# Altium schematic sheet CW308_VoltageFollower.SchDoc
size A4
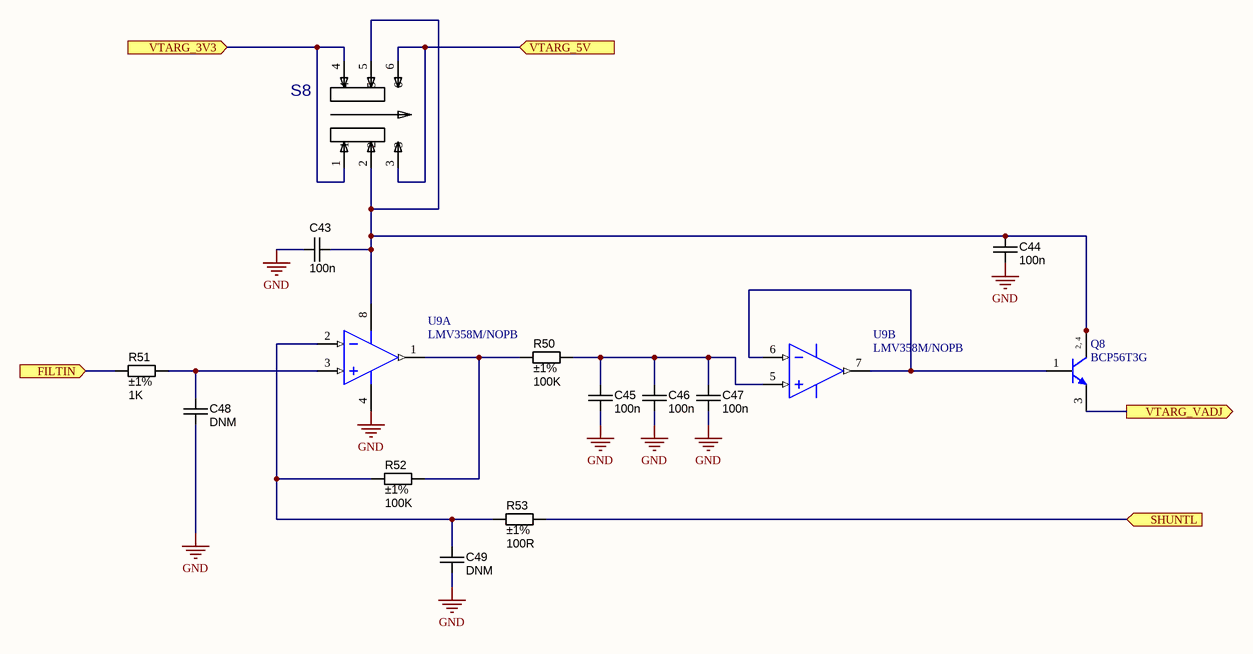
[diagram p0: CW308_VoltageFollower.SchDoc]

## Parts
(Parts that share a designator on the sheet are numbered #1, #2 ... from top to bottom, then left to right.)
C43  value 100n  [CAPC1608X90N]  (hidden comment: approved sub OK)  (no BOM)
C44  value 100n  [CAPC1608X90N]  (hidden comment: approved sub OK)  (no BOM)
C45  value 100n  [CAPC1608X90N]  (hidden comment: approved sub OK)  (no BOM)
C46  value 100n  [CAPC1608X90N]  (hidden comment: approved sub OK)  (no BOM)
C47  value 100n  [CAPC1608X90N]  (hidden comment: approved sub OK)  (no BOM)
C48  value DNM  [CAPC1608X90N]  (hidden comment: approved sub OK)  (no BOM)
C49  value DNM  [CAPC1608X90N]  (hidden comment: approved sub OK)  (no BOM)
Q8  BCP56T3G  [ONSC-SOT-223-4-318E-04_V]
R50  value 100K  Tolerance: ±1%  [RESC1608X55N]  (hidden comment: Thick Film)
R51  value 1K  Tolerance: ±1%  [RESC1608X55N]  (hidden comment: Thick Film)
R52  value 100K  Tolerance: ±1%  [RESC1608X55N]  (hidden comment: Thick Film)
R53  value 100R  Tolerance: ±1%  [RESC1608X55N]  (hidden comment: Thick Film)
S8  JS202011SCQN  [SW_JS202011SCQN]  (value not drawn)
U9#1  LMV358M/NOPB  [D0008A_L]  (part A of 2)
U9#2  LMV358M/NOPB  [D0008A_L]  (part B of 2)

## Ports
FILTIN (in), SHUNTL (in), VTARG_3V3 (in), VTARG_5V (in), VTARG_VADJ (out)

## Nets
GND: C43.1 C44.1 C45.2 C46.2 C47.2 C48.2 C49.2 U9#1.4(V-)
FILTIN: R51.1 ; port FILTIN
SHUNTL: R53.1 ; port SHUNTL
VTARG_3V3: S8.1 S8.4 ; port VTARG_3V3
VTARG_5V: S8.3 S8.6 ; port VTARG_5V
VTARG_VADJ: Q8.3(E) ; port VTARG_VADJ
NetC43_2: C43.2 C44.2 Q8.2(C) Q8.4(C) S8.2 S8.5 U9#1.8(V+)
NetC45_1: C45.1 C46.1 C47.1 R50.2 U9#2.5(INB+)
NetC48_1: C48.1 R51.2 U9#1.3(INA+)
NetC49_1: C49.1 R52.1 R53.2 U9#1.2(INA-)
NetQ8_1: Q8.1(B) U9#2.6(INB-) U9#2.7(OUTB)
NetR50_1: R50.1 R52.2 U9#1.1(OUTA)

Not connected (* = marked no-connect by the designer): U9#2 4(V-) 8(V+)

## Notes on the sheet
- (in symbol CMP-1048-00524-1) 2, 4

## Library data of the parts
C43-C49 = CAPC_100n_0603_X7R_50V_10%: Capacitor SMD Cer 100nF 10% 50V X7R 0603; Manufacturer 1: AVX Corporation; Manufacturer Part Number 1: 06035C104KAT2A; Ratings: 50V; X7R; Material: ceramic; SCDType: spec; Manufacturer 2: TDK Corporation; Manufacturer Part Number 2: C1608X7R1H104K; Package / Case: 0603 (1608 Metric); Tolerance: ±10%; Supplier 1: Digi-Key; Supplier Part Number 1: 478-5052-1-ND; ComponentLink1URL: http://www.avx.com/docs/Catalogs/cx7r.pdf; ComponentLink1Description: http://www.avx.com/docs/Catalogs/cx7r.pdf; Supplier 2: Digi-Key; Supplier Part Number 2: 445-1314-1-ND; ComponentLink2URL: http://product.tdk.com/capacitor/mlcc/en/documents/mlcc_commercial_general_en.pdf; ComponentLink2Description: http://product.tdk.com/capacitor/mlcc/en/documents/mlcc_commercial_general_en.pdf
Q8 = CMP-1048-00524-1: NPN Silicon Epitaxial Transistor, 4-Pin SOT-223, Pb-Free, Tape and Reel; Manufacturer: On Semiconductor; IC Continuous (A): 1; PackageDescription: 4-Pin Small Outline Transistor, Body 6.5 x 3.5 mm, Pitch 2.3 mm; ComponentLink1URL: http://www.onsemi.com/; Mounting Technology: Surface Mount; Polarity: NPN; PackageVersion: Rev. N, 08/2009; Packing: Tape and Reel; RoHS: TRUE; ComponentLink1Description: Manufacturer URL; ComponentLink3Description: Package Specification; PartNumber: BCP56T3G; ComponentLink2Description: Datasheet; ComponentLink2URL: http://www.onsemi.com/pub_link/Collateral/BCP56T1-D.PDF; DatasheetVersion: Rev. 8; ComponentLink3URL: http://www.onsemi.com/pub_link/Collateral/318E-04.PDF; PackageReference: SOT-223-4-318E-04
R50 R52 = RES_100K_0603_1%: Resistor SMD chip 100k Ohm 0.1W 1% 0603; Manufacturer 1: Vishay/Dale; Manufacturer Part Number 1: CRCW0603100KFKEA; Ratings: 1/10W; SCDType: spec; Package / Case: 0603 (2012 metric); Supplier 1: Digi-Key; Supplier Part Number 1: 541-100KHCT-ND
R51 = RES_1K_0603_1%: Resistor SMD chip 1k Ohm 0.1W 1% 0603; Manufacturer 1: Yageo; Manufacturer Part Number 1: RC0603FR-071KL; Ratings: 1/10W; SCDType: spec; Package / Case: 0603 (1608 Metric); Supplier 1: Digi-Key; Supplier Part Number 1: 311-1.00KHRCT-ND
R53 = RES_100R_0603_1%: Resistor SMD chip 100 Ohm 0.1W 1% 0603; Manufacturer 1: Yageo; Manufacturer Part Number 1: RC0603FR-07100RL; Ratings: 1/10 W; SCDType: spec; Package / Case: 0603 (1608 Metric); Material: Thick Film; Supplier 1: Digi-Key; Supplier Part Number 1: 311-100HRCT-ND; Supplier 2: Digi-Key; Supplier Part Number 2: P100HTR-ND; Manufacturer 2: Panasonic - ECG; Manufacturer Part Number 2: ERJ-3EKF1000V; ComponentLink1URL: http://industrial.panasonic.com/www-cgi/jvcr13pz.cgi?E+PZ+3+AOA0002+ERJ3EKF1000V+7+WW; ComponentLink1Description: http://industrial.panasonic.com/www-cgi/jvcr13pz.cgi?E+PZ+3+AOA0002+ERJ3EKF1000V+7+WW
S8 = JS202011SCQN: DPDT SMD Switch, 300mA; Manufacture 1: C&K Components; Value: DPDT; Supplier 1: Digi-Key; Manufacture Part Number 1: JS202011SCQN; Supplier Part Number 1: 401-2002-1-ND
U9#1 U9#2 = CMP-0055-00564-3: General Purpose, Low Voltage, Rail-to-Rail Output Operational Amplifiers, 8-pin Narrow SOIC, Pb-Free; Manufacturer: Texas Instruments; PackageTopMarking: NSZXTT*LMV*358M; PowerWise: N; Package Reference: D0008A; ComponentLink1Description: Datasheet URL; CompType: Amplifiers; Code_IPC: SOIC127P600-8; PackageDescription: SOIC Narrow, 4.9 x 3.9 x 1.45mm, 8 Lead, 1.27mm Pitch; RoHS: Y; PinCount: 8; Code_JEDEC: MS-012-AA; ComponentLink1URL: http://www.ti.com/general/docs/lit/getliterature.tsp?genericPartNumber=LMV358-N&fileType=pdf; PartId: 1